# Altium schematic sheet VDMEDA_IOExpander.SchDoc
size A4
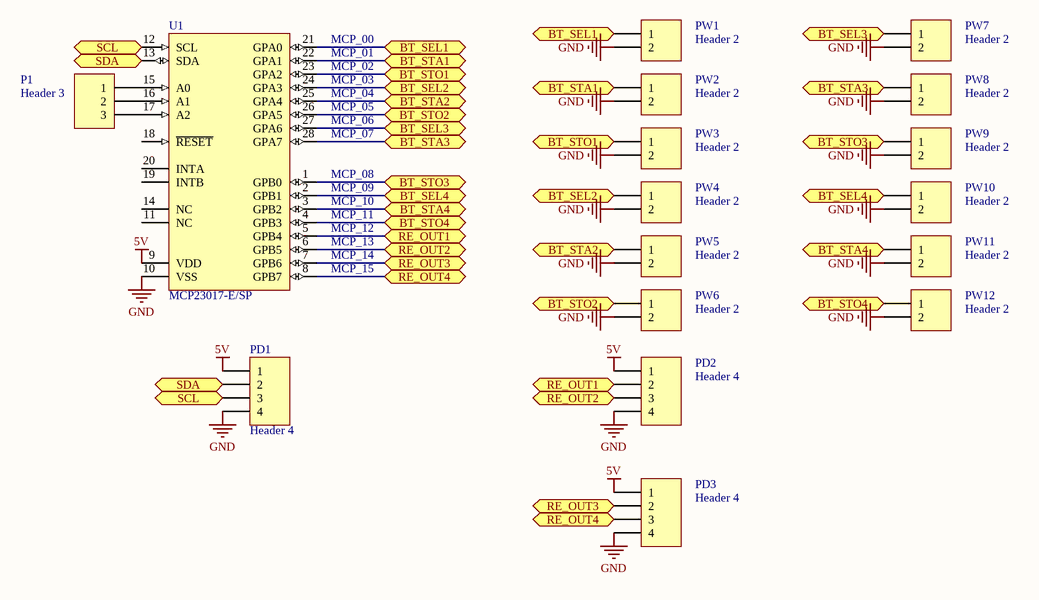
[diagram p0: VDMEDA_IOExpander.SchDoc]

## Parts
P1  Header 3  [HDR1X3]
PD1  Header 4  [HDR1X4]
PD2  Header 4  [HDR1X4]
PD3  Header 4  [HDR1X4]
PW1  Header 2  [TO-220_A]
PW2  Header 2  [TO-220_A]
PW3  Header 2  [TO-220_A]
PW4  Header 2  [TO-220_A]
PW5  Header 2  [TO-220_A]
PW6  Header 2  [TO-220_A]
PW7  Header 2  [TO-220_A]
PW8  Header 2  [TO-220_A]
PW9  Header 2  [TO-220_A]
PW10  Header 2  [TO-220_A]
PW11  Header 2  [TO-220_A]
PW12  Header 2  [TO-220_A]
U1  MCP23017-E/SP  [SPDIP300-SP28]

## Ports
BT_SEL1 (bidir), BT_SEL2 (bidir), BT_SEL3 (bidir), BT_SEL4 (bidir), BT_STA1 (bidir), BT_STA2 (bidir), BT_STA3 (bidir), BT_STA4 (bidir), BT_STO1 (bidir), BT_STO2 (bidir), BT_STO3 (bidir), BT_STO4 (bidir), RE_OUT1 (bidir), RE_OUT2 (bidir), RE_OUT3 (bidir), RE_OUT4 (bidir), SCL (bidir), SDA (bidir)

## Nets
5V: PD1.1 PD2.1 PD3.1 U1.9(VDD)
GND: PD1.4 PD2.4 PD3.4 PW1.2 PW2.2 PW3.2 PW4.2 PW5.2 PW6.2 PW7.2 PW8.2 PW9.2 PW10.2 PW11.2 PW12.2 U1.10(VSS)
BT_SEL1: PW1.1 U1.21(GPA0) ; port BT_SEL1
BT_SEL2: PW4.1 U1.24(GPA3) ; port BT_SEL2
BT_SEL3: PW7.1 U1.27(GPA6) ; port BT_SEL3
BT_SEL4: PW10.1 U1.2(GPB1) ; port BT_SEL4
BT_STA1: PW2.1 U1.22(GPA1) ; port BT_STA1
BT_STA2: PW5.1 U1.25(GPA4) ; port BT_STA2
BT_STA3: PW8.1 U1.28(GPA7) ; port BT_STA3
BT_STA4: PW11.1 U1.3(GPB2) ; port BT_STA4
BT_STO1: PW3.1 U1.23(GPA2) ; port BT_STO1
BT_STO2: PW6.1 U1.26(GPA5) ; port BT_STO2
BT_STO3: PW9.1 U1.1(GPB0) ; port BT_STO3
BT_STO4: PW12.1 U1.4(GPB3) ; port BT_STO4
RE_OUT1: PD2.2 U1.5(GPB4) ; port RE_OUT1
RE_OUT2: PD2.3 U1.6(GPB5) ; port RE_OUT2
RE_OUT3: PD3.2 U1.7(GPB6) ; port RE_OUT3
RE_OUT4: PD3.3 U1.8(GPB7) ; port RE_OUT4
SCL: PD1.3 U1.12(SCL) ; port SCL
SDA: PD1.2 U1.13(SDA) ; port SDA
NetP1_1: P1.1 U1.15(A0)
NetP1_2: P1.2 U1.16(A1)
NetP1_3: P1.3 U1.17(A2)

Not connected (* = marked no-connect by the designer): U1 11(NC) 14(NC) 18(~{RESET}) 19(INTB) 20(INTA)

## Notes on the sheet
- (near U1) MCP_00
- (near U1) MCP_01
- (near U1) MCP_02
- (near U1) MCP_03
- (near U1) MCP_04
- (near U1) MCP_05
- (near U1) MCP_06
- (near U1) MCP_07
- (near U1) MCP_08
- (near U1) MCP_09
- (near U1) MCP_10
- (near U1) MCP_11
- (near U1) MCP_12
- (near U1) MCP_13
- (near U1) MCP_14
- (near U1) MCP_15

## Library data of the parts
P1 = Header 3: Header, 3-Pin; LatestRevisionDate: 17-Jul-2002; LatestRevisionNote: Re-released for DXP Platform.; Publisher: Altium Limited
PD1-PD3 = Header 4: Header, 4-Pin; LatestRevisionDate: 17-Jul-2002; LatestRevisionNote: Re-released for DXP Platform.; Publisher: Altium Limited
PW1-PW12 = Header 2: Header, 2-Pin; pin to pad: 2>3; LatestRevisionDate: 17-Jul-2002; LatestRevisionNote: Re-released for DXP Platform.; Publisher: Altium Limited
U1 = MCP23017-E/SP: 16-Bit I/O Expander with Serial Interface, 28-Pin SPDIP, Extended Temperature; Published: 29-Jan-2009; DatasheetVersion: revB, Feb-2007; PackageVersion: revBB, Aug-2009; PackageReference: SPDIP300-SP28; Publisher: Altium Limited; PackageDescription: 28-Lead Skinny Plastic Dual In-Line (SP) - 300 mil Body [SPDIP]; Supplier 1: Digi-Key; Supplier Part Number 1: MCP23017-E/SP-ND; Supplier 2: Farnell; Supplier Part Number 2: 1332088; ComponentLink1Description: Datasheet; ComponentLink1URL: http://ww1.microchip.com/downloads/en/DeviceDoc/21952b.pdf; ComponentLink2Description: Packaging Specification; ComponentLink2URL: http://www.microchip.com/stellent/groups/techpub_sg/documents/packagingspec/en012702.pdf; ComponentLink3Description: Microchip.com Home; ComponentLink3URL: http://www.microchip.com/